# EAGLE design Mechatronics_Detector (EAGLE 5.06)
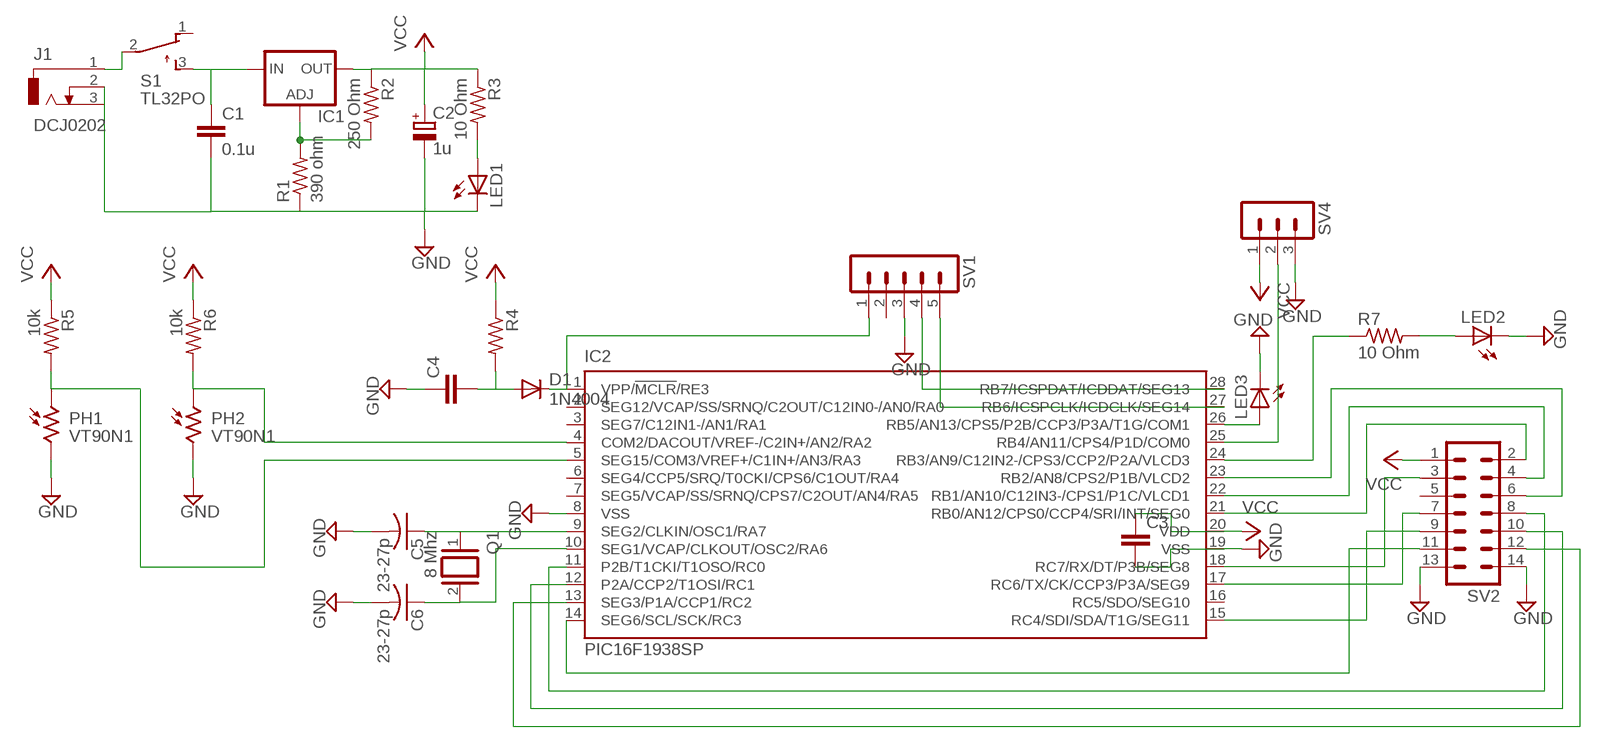
[diagram p0: schematic, sheet 1]

## Parts
C1  0.1u  C-EU025-025X050  [C025-025X050]
C2  1u  CPOL-EUE2-5  [E2-5]
C3  C-EU025-025X050  [C025-025X050]
C4  C-EU025-025X050  [C025-025X050]
C5  23-27p  C-US025-024X044  [C025-024X044]
C6  23-27p  C-US025-024X044  [C025-024X044]
D1  1N4004  [DO41-10]
IC1  LM317TS  [317TS]
IC2  PIC16F1938SP  [DIL28-3]
J1  DCJ0202  [DCJ0202]
LED1  LED5MM  [LED5MM]
LED2  LED5MM  [LED5MM]
LED3  LED5MM  [LED5MM]
PH1  VT90N1  [VT900]
PH2  VT90N1  [VT900]
Q1  8 Mhz  XTAL/S  [QS]
R1  390 ohm  R-US_0207/10  [0207/10]
R2  250 Ohm  R-US_0207/10  [0207/10]
R3  10 Ohm  R-US_0207/10  [0207/10]
R4  R-US_0207/10  [0207/10]
R5  10k  R-US_0207/10  [0207/10]
R6  10k  R-US_0207/10  [0207/10]
R7  10 Ohm  R-US_0207/10  [0207/10]
S1  TL32PO  [TL3XPO]
SV1  MA05-1  [MA05-1]
SV2  MA07-2  [MA07-2]
SV4  MA03-1  [MA03-1]

## Nets
GND: C1.2 C2.- C3.2 C4.1 C5.2 C6.2 IC2.8(VSS) IC2.19(VSS) J1.2 J1.3 LED1.K(C) LED2.K(C) LED3.K(C) PH1.2 PH2.2 R1.1 SV1.3 SV2.13 SV2.14 SV4.3
N$1: LED1.A R3.2
N$2: C1.1 IC1.3(IN) S1.3(S)
N$3: IC1.1(ADJ) R1.2 R2.2
N$4: IC2.4(COM2/DACOUT/VREF-/C2IN+/AN2/RA2) PH2.1 R6.2
N$5: J1.1 S1.2(P)
N$6: IC2.5(SEG15/COM3/VREF+/C1IN+/AN3/RA3) PH1.1 R5.2
N$7: C4.2 D1.A R4.2
N$8: D1.C IC2.1(VPP/!MCLR!/RE3) SV1.1
N$9: IC2.25(RB4/AN11/CPS4/P1D/COM0) SV4.2
N$10: IC2.28(RB7/ICSPDAT/ICDDAT/SEG13) SV1.4
N$11: IC2.27(RB6/ICSPCLK/ICDCLK/SEG14) SV1.5
N$12: IC2.21(RB0/AN12/CPS0/CCP4/SRI/INT/SEG0) SV2.2
N$13: IC2.18(RC7/RX/DT/P3B/SEG8) SV2.3
N$14: IC2.22(RB1/AN10/C12IN3-/CPS1/P1C/VLCD1) SV2.4
N$15: IC2.23(RB2/AN8/CPS2/P1B/VLCD2) SV2.6
N$16: IC2.17(RC6/TX/CK/CCP3/P3A/SEG9) SV2.7
N$17: IC2.11(P2B/T1CKI/T1OSO/RC0) SV2.8
N$18: C5.1 IC2.9(SEG2/CLKIN/OSC1/RA7) Q1.1
N$19: C6.1 IC2.10(SEG1/VCAP/CLKOUT/OSC2/RA6) Q1.2
N$20: IC2.15(RC4/SDI/SDA/T1G/SEG11) SV2.9
N$21: IC2.12(P2A/CCP2/T1OSI/RC1) SV2.10
N$22: IC2.14(SEG6/SCL/SCK/RC3) SV2.11
N$23: IC2.13(SEG3/P1A/CCP1/RC2) SV2.12
N$29: LED2.A R7.2
N$30: IC2.24(RB3/AN9/C12IN2-/CPS3/CCP2/P2A/VLCD3) R7.1
N$33: IC2.26(RB5/AN13/CPS5/P2B/CCP3/P3A/T1G/COM1) LED3.A
VCC: C2.+ C3.1 IC1.2(OUT) IC2.20(VDD) R2.1 R3.1 R4.1 R5.1 R6.1 SV2.1 SV4.1
Unconnected: IC2.2(SEG12/VCAP/SS/SRNQ/C2OUT/C12IN0-/AN0/RA0) IC2.3(SEG7/C12IN1-/AN1/RA1) IC2.6(SEG4/CCP5/SRQ/T0CKI/CPS6/C1OUT/RA4) IC2.7(SEG5/VCAP/SS/SRNQ/CPS7/C2OUT/AN4/RA5) IC2.16(RC5/SDO/SEG10) S1.1(O) SV1.2 SV2.5

## Library data of the parts
C1 C3 C4 = rcl:C-EU: CAPACITOR, European symbol
C2 = rcl:CPOL-EU: POLARIZED CAPACITOR, European symbol
C5 C6 = rcl:C-US: CAPACITOR, American symbol
D1 = diode:1N4004: DIODE general purpose rectifier, 1 A
IC1 = v-reg:LM317TS: VOLTAGE REGULATOR
IC2 = microchip-update-2:PIC16F19*: Flash-Based, 8-Bit CMOS Microcontrollers wtih LCD Driver and nanoWatt XLP Technology Auto generated by make-symbol-device-package-bsdl.ulp Rev. 33 Source: http://ww1.microchip.com/downloads/en/DeviceDoc/41364D.pdf
J1 = con-jack:DCJ0202: DC POWER JACK Source: DCJ0202.pdf
LED1-LED3 = led:LED: LED OSRAM: - CHIPLED LG R971, LG N971, LY N971, LG Q971, LY Q971, LO R971, LY R971 LH N974, LH R974 LS Q976, LO Q976, LY Q976 LO Q996 - Hyper CHIPLED LW Q18S LB Q993, LB Q99A, LB R99A - SideLED LS A670, LO A670, LY A670, LG A670, LP A670 LB A673, LV A673, LT A673, LW A673 LH A674 LY A675 LS A676, LA A676, LO A676, LY A676, LW A676 LS A679, LY A679, LG A679 - Hyper Micro SIDELED® LS Y876, LA Y876, LO Y876, LY Y876 LT Y87S - SmartLED LW L88C, LW L88S LB L89C, LB L89S, LG L890 LS L89K, LO L89K, LY L89K LS L896, LA L896, LO L896, LY L896 - TOPLED LS T670, LO T670, LY T670, LG T670, LP T670 LSG T670, LSP T670, LSY T670, LOP T670, LYG T670 LG T671, LOG T671, LSG T671 LB T673, LV T673, LT T673, LW T673 LH T674 LS T676, LA T676, LO T676, LY T676, LB T676, LH T676, LSB T676, LW T676 LB T67C, LV T67C, LT T67C, LS T67K, LO T67K, LY T67K, LW E67C LS E67B, LA E67B, LO E67B, LY E67B, LB E67C, LV E67C, LT E67C LW T67C LS T679, LY T679, LG T679 LS T770, LO T770, LY T770, LG T770, LP T770 LB T773, LV T773, LT T773, LW T773 LH T774 LS E675, LA E675, LY E675, LS T675 LS T776, LA T776, LO T776, LY T776, LB T776 LHGB T686 LT T68C, LB T68C - Hyper Mini TOPLED® LB M676 - Mini TOPLED Santana® LG M470 LS M47K, LO M47K, LY M47K Source: http://www.osram.convergy.de LUXEON: - LUMILED® LXK2-PW12-R00, LXK2-PW12-S00, LXK2-PW14-U00, LXK2-PW14-V00 LXK2-PM12-R00, LXK2-PM12-S00, LXK2-PM14-U00 LXK2-PE12-Q00, LXK2-PE12-R00, LXK2-PE12-S00, LXK2-PE14-T00, LXK2-PE14-U00 LXK2-PB12-K00, LXK2-PB12-L00, LXK2-PB12-M00, LXK2-PB14-N00, LXK2-PB14-P00, LXK2-PB14-Q00 LXK2-PR12-L00, LXK2-PR12-M00, LXK2-PR14-Q00, LXK2-PR14-R00 LXK2-PD12-Q00, LXK2-PD12-R00, LXK2-PD12-S00 LXK2-PH12-R00, LXK2-PH12-S00 LXK2-PL12-P00, LXK2-PL12-Q00, LXK2-PL12-R00 Source: www.luxeon.com KINGBRIGHT: KA-3528ASYC Source: www.kingbright.com
PH1 PH2 = photo-elements:VT9: Photoconductive Cell VT900 Series Source: http://optoelectronics.perkinelmer.com/content/Datasheets/DTS_vt900seriesdatasheet.pdf
Q1 = special:XTAL/S: CRYSTAL
R1-R7 = resistor:R-US_: RESISTOR, American symbol
S1 = switch:TL32PO: TINY SWITCH ON - MOM Source: http://www2.produktinfo.conrad.com/datenblaetter/700000-724999/705152-da-01-de-Subminiaturschalter_TL_36YO.pdf
SV1 = con-lstb:MA05-1: PIN HEADER
SV2 = con-lstb:MA07-2: PIN HEADER
SV4 = con-lstb:MA03-1: PIN HEADER

## Board
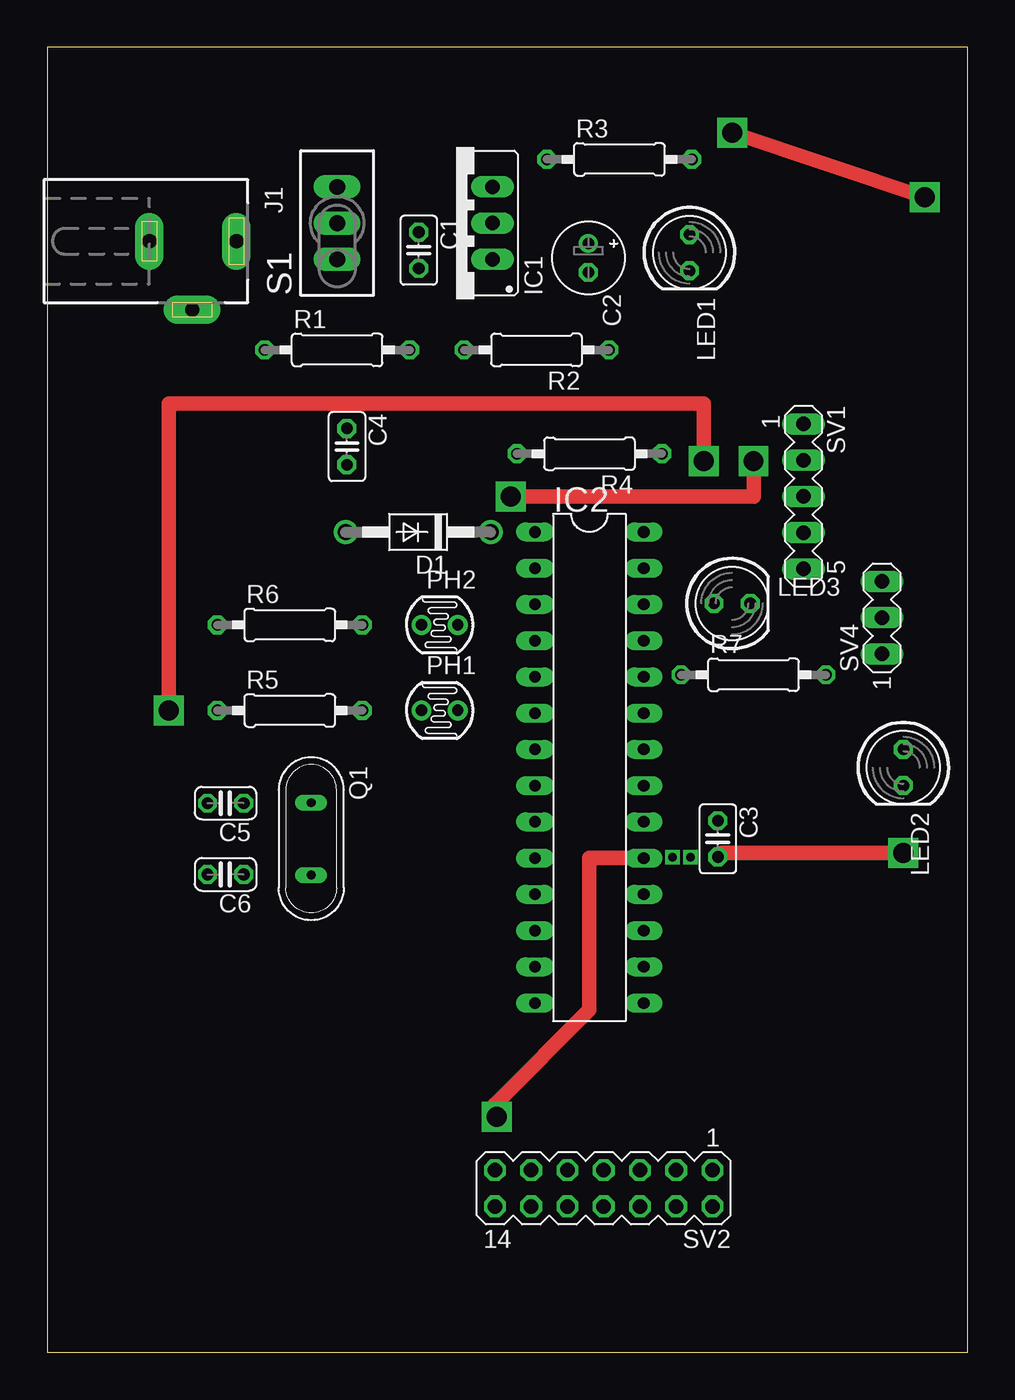
[diagram p1: board, top side]
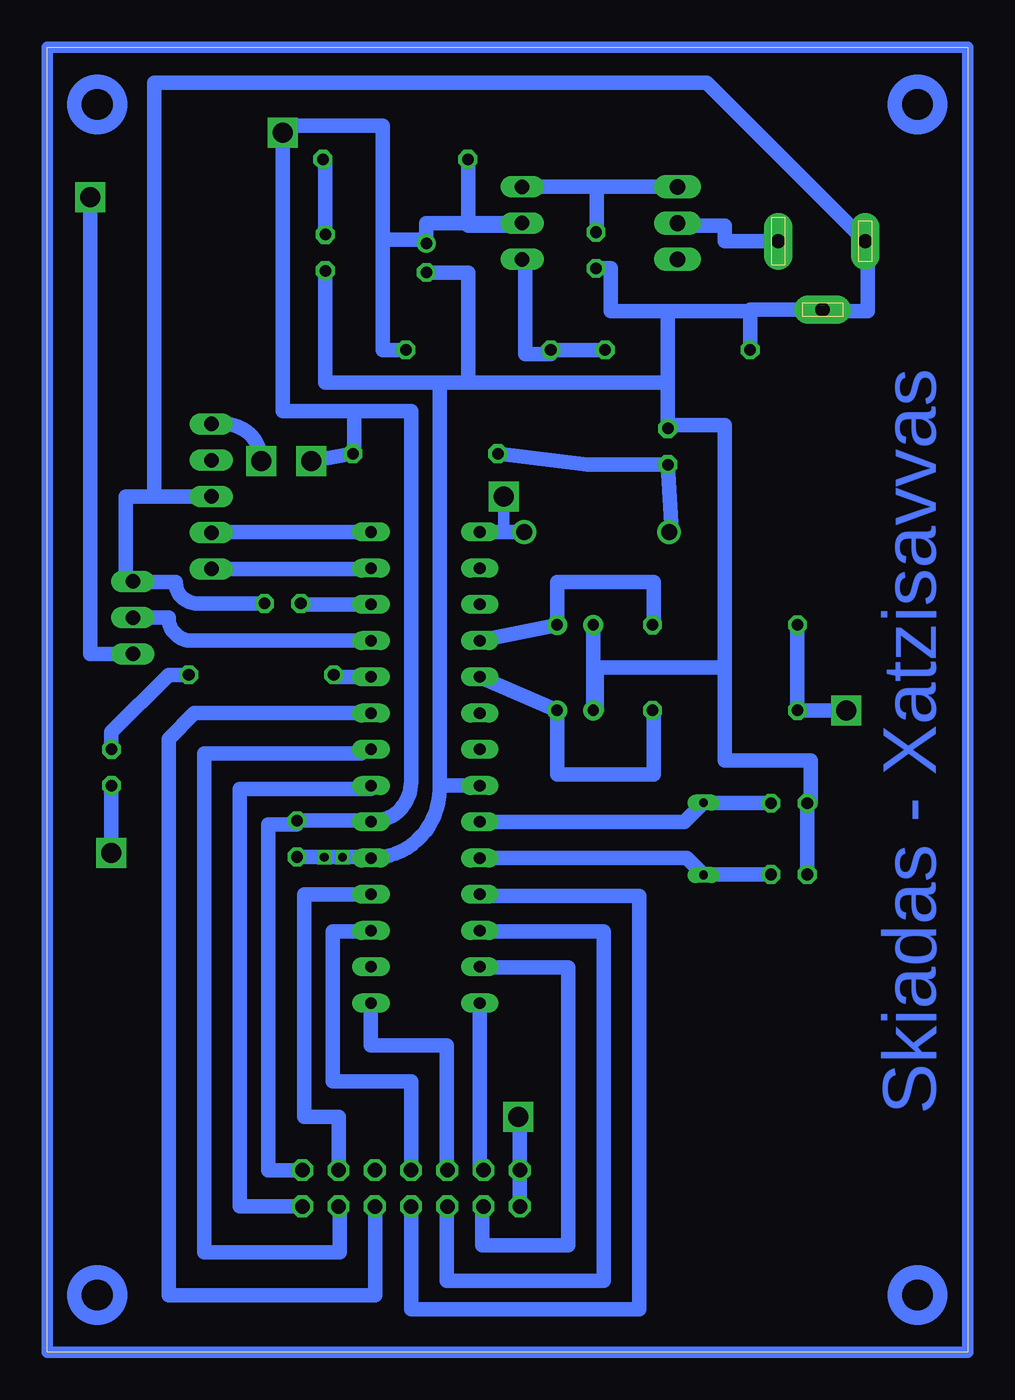
[diagram p2: board, bottom side, seen from below]

Size 64.5 x 91.5 mm. Coordinates in mm from the lower left corner, seen from the top.
Outline: 0,0 64.5,0 64.5,91.5 0,91.5 0,0
Copper layers (1*16): Top 0.035mm / dielectric 1.5mm / Bottom 0.035mm
Design rules "default": minimum track width 10mil, minimum drill 24mil, track to track 8mil, track to pad 8mil, pad to pad 8mil, via to via 8mil, smd to smd 8mil, copper to edge 40mil, drill to drill 8mil, minimum pad ring 10mil, minimum via ring 8mil, stop-mask expansion 4mil, vias tented up to drill 0mil, thermal gap 10mil

### Footprints (pad centres in the part's own frame; a part is rotated, then mirrored left to right if it is on the bottom)
C025-025X050 = drill 0.813 octagon: 1 -1.27,0; 2 1.27,0
E2-5 = drill 0.813 pad 1.27 round: + -1.016,0 | drill 0.813 pad 1.27 octagon: - 1.016,0
C025-024X044 = drill 0.813 octagon: 1 -1.27,0; 2 1.27,0
DO41-10 = drill 1.118 round: A 5.08,0; C -5.08,0
317TS = drill 1.016 long: 1 -2.54,-2.54; 2 0,-2.54; 3 2.54,-2.54
DIL28-3 = drill 0.813 long: 1 -16.51,-3.81; 2 -13.97,-3.81; 3 -11.43,-3.81; 4 -8.89,-3.81; 5 -6.35,-3.81; 6 -3.81,-3.81; 7 -1.27,-3.81; 8 1.27,-3.81; 9 3.81,-3.81; 10 6.35,-3.81; 11 8.89,-3.81; 12 11.43,-3.81; 13 13.97,-3.81; 14 16.51,-3.81; 15 16.51,3.81; 16 13.97,3.81; 17 11.43,3.81; 18 8.89,3.81; 19 6.35,3.81; 20 3.81,3.81; 21 1.27,3.81; 22 -1.27,3.81; 23 -3.81,3.81; 24 -6.35,3.81; 25 -8.89,3.81; 26 -11.43,3.81; 27 -13.97,3.81; 28 -16.51,3.81
DCJ0202 = drill 1 pad 2 long: 1 0,3.1; 2 4.8,0; 3 0,-3
LED5MM = drill 0.813 octagon: A -1.27,0; K 1.27,0
VT900 = drill 0.8 pad 1.4 round: 1 -1.27,0; 2 1.27,0
QS = drill 0.61 long: 1 -2.54,0; 2 2.54,0
0207/10 = drill 0.813 octagon: 1 -5.08,0; 2 5.08,0
TL3XPO = drill 1.1 pad 1.422 long: 1 -2.54,0; 2 0,0; 3 2.54,0
MA05-1 = drill 1.016 long: 1 -5.08,0; 2 -2.54,0; 3 0,0; 4 2.54,0; 5 5.08,0
MA07-2 = drill 1.016 octagon: 1 -7.62,-1.27; 2 -7.62,1.27; 3 -5.08,-1.27; 4 -5.08,1.27; 5 -2.54,-1.27; 6 -2.54,1.27; 7 0,-1.27; 8 0,1.27; 9 2.54,-1.27; 10 2.54,1.27; 11 5.08,-1.27; 12 5.08,1.27; 13 7.62,-1.27; 14 7.62,1.27
MA03-1 = drill 1.016 long: 1 -2.54,0; 2 0,0; 3 2.54,0

### Placement (x,y rotation side)
C1  26.04,77.27 270 top
C2  37.92,76.72 270 top
C3  47,36 270 top
C4  21,63.5 270 top
C5  12.5,38.5 180 top
C6  12.5,33.5 180 top
D1  26,57.5 180 top
IC1  28.67,79.17 90 top
IC2  38,41 270 top
J1  10.16,77.9 270 top
LED1  45.01,77.1 270 top
LED2  60,41 270 top
LED3  48,52.5 0 top
PH1  27.5,45 180 top
PH2  27.5,51 180 top
Q1  18.5,36 270 top
R1  20.32,70.28 0 top
R2  34.29,70.28 180 top
R3  40.1,83.64 0 top
R4  38,63 180 top
R5  17,45 0 top
R6  17,51 0 top
R7  49.5,47.5 0 top
S1  20.32,79.17 90 top
SV1  53,60 270 top
SV2  39,11.5 180 top
SV4  58.5,51.5 90 top

### Tracks (layer width: path | path; a pad name or v marks a point on that pad's centre or on a via)
GND  (via drill 1.4)
  Top 1.016: 31.5,17.5 38,24 38,34.65 IC2.19 | 31.5,17.5 31.38,17.38 | v60,35 47.27,35 C3.2 | v31.5,16.5 31.5,17.5
  Bottom 1.016: 15,73.1 J1.2 10.16,73 7,73 7,77.9 J1.3 18.26,89 57,89 57,60 56.5,60 | 15,73.1 15.24,73.1 R1.1 | C1.2 25,76 25,73 21,73 | 21,73 15,73 15,73.1 | C2.- 35,75.71 35,68 | 35,68 21,68 | 21,68 21,73 | LED1.K 45,68 37,68 | 37,68 35,68 | 37,39.73 IC2.8 | 37,39.73 37,68 | 37,39.73 37,39.46 arc90 IC2.19 41.81,34.73 C3.2 | SV2.14 SV2.13 | SV2.13 31.11,12.77 | 56.5,60 SV1.3 | 21,68 C4.1 21,65 17,65 17,48 | C6.2 C5.2 11,38.5 11,41.5 17,41.5 17,48 | 26.23,48 PH1.2 26,45 26,48 | 26.23,48 PH2.2 | 26,48 26.23,48 | 17,48 26,48 | 59,54.04 SV4.3 | 59,54.04 59,60 56.5,60 | v60,35 LED2.K | SV2.13 31.38,16.38 v31.5,16.5 | LED3.K 54,52.5 arc90 55.5,54 58.96,54 arc90 59,54.04
N$1
  Bottom 1.016: R3.2 45.01,83.64 LED1.A
N$2
  Bottom 1.016: S1.3 26,81.71 | 26,81.71 IC1.3 | C1.1 26,78.53 26,81.71
N$3
  Bottom 1.016: R1.2 R2.2 29.21,70 31,70 31,76.63 IC1.1
N$4
  Bottom 1.016: IC2.4 PH2.1 28.77,54 22,54 22,51 R6.2
N$5
  Bottom 1.016: J1.1 17,77.9 17,79 20.32,79 S1.2
N$6
  Bottom 1.016: R5.2 22,45 22,40.5 28.77,40.5 PH1.1 IC2.5
N$7
  Bottom 1.016: D1.A 20.73,57.5 C4.2 26.65,62.23 R4.2
N$8  (via drill 1.4)
  Top 1.016: v32.5,60 49.5,60 v49.5,62.5
  Bottom 0.813: 32.5,57.5 v32.5,60
  Bottom 1.016: D1.C 32.5,57.5 IC2.1 | SV1.1 52.08,65.08 arc90 v49.5,62.5
N$9
  Bottom 1.016: IC2.25 54.39,49.89 arc90 56,51.5 SV4.2
N$10
  Bottom 1.016: IC2.28 53,57.51 SV1.4
N$11
  Bottom 1.016: SV1.5 41.81,54.92 IC2.27
N$12
  Bottom 1.016: SV2.2 51,10.23 51,39.5 41.81,39.5 IC2.21
N$13
  Bottom 1.016: IC2.18 46.5,32.11 46.5,16.5 44.08,16.5 SV2.3
N$14
  Bottom 1.016: SV2.4 44,10.23 44,7 53.5,7 53.5,42 42.5,42 42.5,42.27 IC2.22
N$15
  Bottom 1.016: SV2.6 41.5,10.23 41.5,4 56,4 56,43 54.19,44.81 IC2.23
N$16
  Bottom 1.016: SV2.7 39,19 44.5,19 44.5,29.5 41.81,29.5 IC2.17
N$17
  Bottom 1.016: SV2.8 39,3 23,3 23,32 34.19,32 IC2.11
N$18
  Bottom 1.016: IC2.9 19.85,37.19 Q1.1 18.46,38.5 C5.1
N$19
  Bottom 1.016: IC2.10 19.69,34.65 Q1.2 18.46,33.5 C6.1
N$20
  Bottom 1.016: SV2.9 36.5,12.77 36.5,21.5 41.81,21.5 IC2.15
N$21
  Bottom 1.016: SV2.10 36.5,10.23 36.5,5 25.5,5 25.5,29.5 34.19,29.5 IC2.12
N$22
  Bottom 1.016: SV2.11 34.19,12.77 IC2.14
N$23
  Bottom 1.016: SV2.12 34,10.23 34,7.5 28,7.5 28,27 34.19,27 IC2.13
N$24
  Bottom 0.813: 0,91.5 64.5,91.5 64.5,0 0,0 0,91.5
N$25  (via drill 1.4)
  other vias: 49.5,62.5
N$26  (via drill 1.4)
  other vias: 32.5,60
N$27  (via drill 1.4)
  other vias: 8.5,45
N$28  (via drill 1.4)
  other vias: 46,62.5
N$29
  Bottom 1.016: R7.2 56,47.5 60,43.5 LED2.A
N$30
  Bottom 1.016: IC2.24 44.42,47.35 R7.1
N$31  (via drill 1.4)
  other vias: 60,35
N$32  (via drill 1.4)
  other vias: 31.5,16.5
N$33
  Bottom 1.016: IC2.26 46.66,52.43 arc90 LED3.A
N$34  (via drill 0.6)
  other vias: 43.81,34.72
N$35  (via drill 0.6)
  other vias: 45.09,34.72
VCC  (via drill 1.4)
  Top 1.016: v48,85.5 v61.5,81 | v8.5,45 8.5,66.5 46,66.5 v46,62.5
  Bottom 1.016: R3.1 35,83.64 35,79 31.21,79 IC1.2 37.92,79.17 C2.+ 37.92,78 41,78 | R2.1 41,70.28 41,78 | 43,66 39,66 39,40 arc90 IC2.20 41.81,37.27 C3.1 47,37 49,37 49,12.77 SV2.1 | 43,66 48,66 v48,85.5 48,86 41,86 41,78 | 43,66 43,63.08 R4.1 v46,62.5 | R6.1 R5.1 v8.5,45 | SV4.1 61.5,48.96 v61.5,81
(copper drawn outside any net)
  shapes: Bottom circle x4

### Text on the board
Bottom: Skiadas - Xatzisavvas